# EAGLE design photodiode (EAGLE 8.3.1)
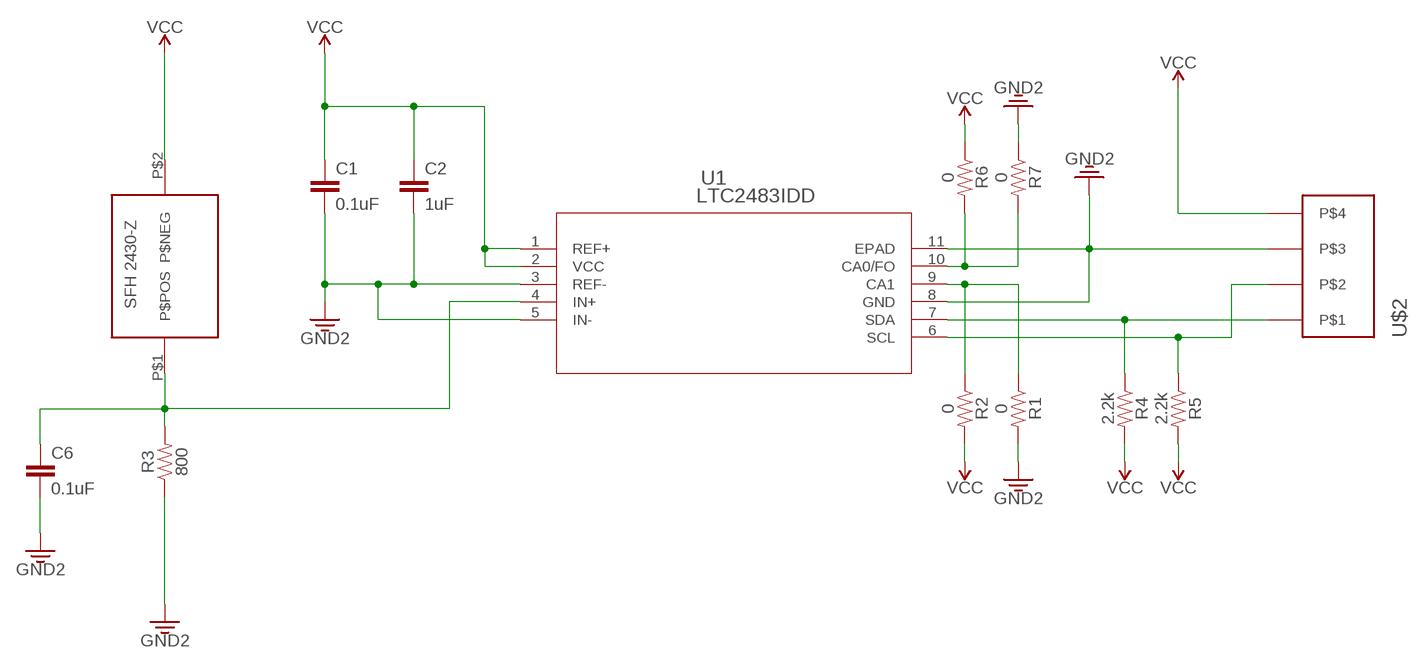
[diagram p0: schematic, sheet 1]

## Parts
C1  0.1uF  0.1UF-0603-100V-10%  [0603]
C2  1uF  0.1UF-0603-100V-10%  [0603]
C6  0.1uF  0.1UF-0603-100V-10%  [0603]
R1  0  RESISTOR0805  [0805]
R2  0  RESISTOR0805  [0805]
R3  800  RESISTOR0805  [0805]
R4  2.2k  RESISTOR0805  [0805]
R5  2.2k  RESISTOR0805  [0805]
R6  0  RESISTOR0805  [0805]
R7  0  RESISTOR0805  [0805]
U1  LTC2483IDD  [DFN-10_DD]
U$1  SFH-2430-Z  [DIL]
U$2  PICOLOCK_4PICOLOCK_4  [PICOLOCK_4]

## Nets
CA0: R6.2 R7.2 U1.10(CA0/FO)
CA1: R1.1 R2.1 U1.9(CA1)
GND: C1.2 C2.2 C6.2 R1.2 R3.1 R7.1 U1.3(REF-) U1.5(IN-) U1.8(GND) U1.11(EPAD) U$2.P$3 ; supply symbol labelled GND2
OUTPUT: C6.1 R3.2 U1.4(IN+) U$1.P$1(P$POS)
SCL: R5.1 U1.6(SCL) U$2.P$2
SDA: R4.1 U1.7(SDA) U$2.P$1
VCC: C1.1 C2.1 R2.2 R4.2 R5.2 R6.1 U1.1(REF+) U1.2(VCC) U$1.P$2(P$NEG) U$2.P$4

## Library data of the parts
C1 C6 = SparkFun-Capacitors:0.1UF: 0.1µF ceramic capacitors A capacitor is a passive two-terminal electrical component used to store electrical energy temporarily in an electric field.; PROD_ID: CAP-08390
C2 = SparkFun-Capacitors:0.1UF: 0.1µF ceramic capacitors A capacitor is a passive two-terminal electrical component used to store electrical energy temporarily in an electric field.; PROD_ID: CAP-08390; VALUE: 0.1uF
R1-R7 = SparkFun-Resistors:RESISTOR: Generic Resistor Package
U1 = LTC2483idd:LTC2483IDD; MANUFACTURER_PART_NUMBER: ltc2483idd; VENDOR: Linear Technology
U$1 = SFH 2430 Z:SFH-2430-Z
U$2 = DubSat1 Components:PICOLOCK_4

## Net classes
0 default: clearance 0.205 mm

## Board
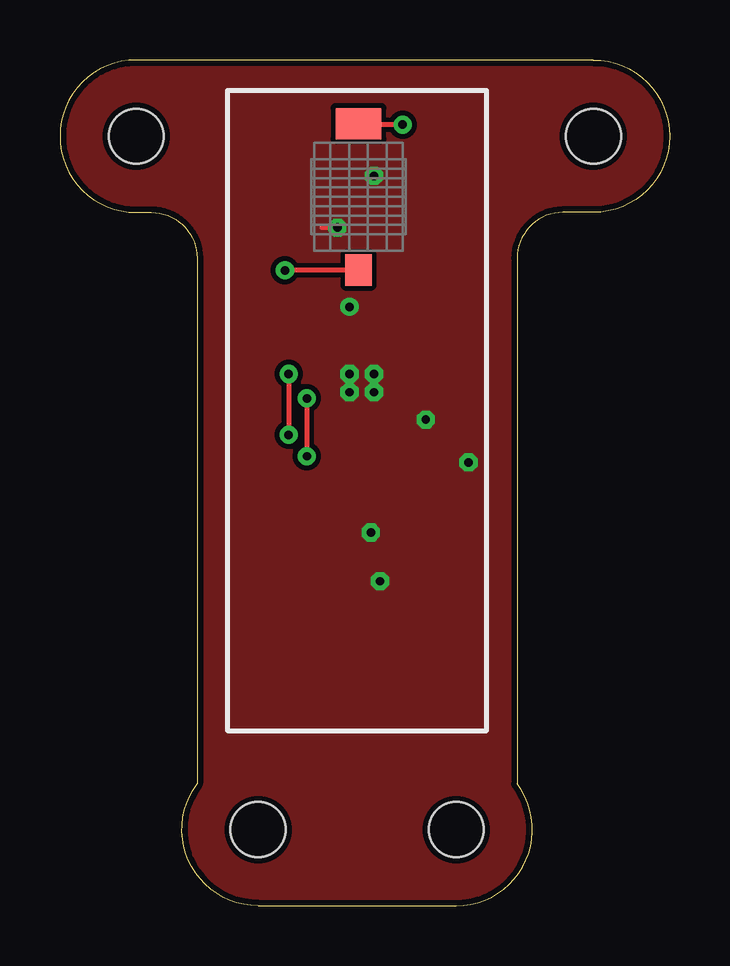
[diagram p1: board, top side]
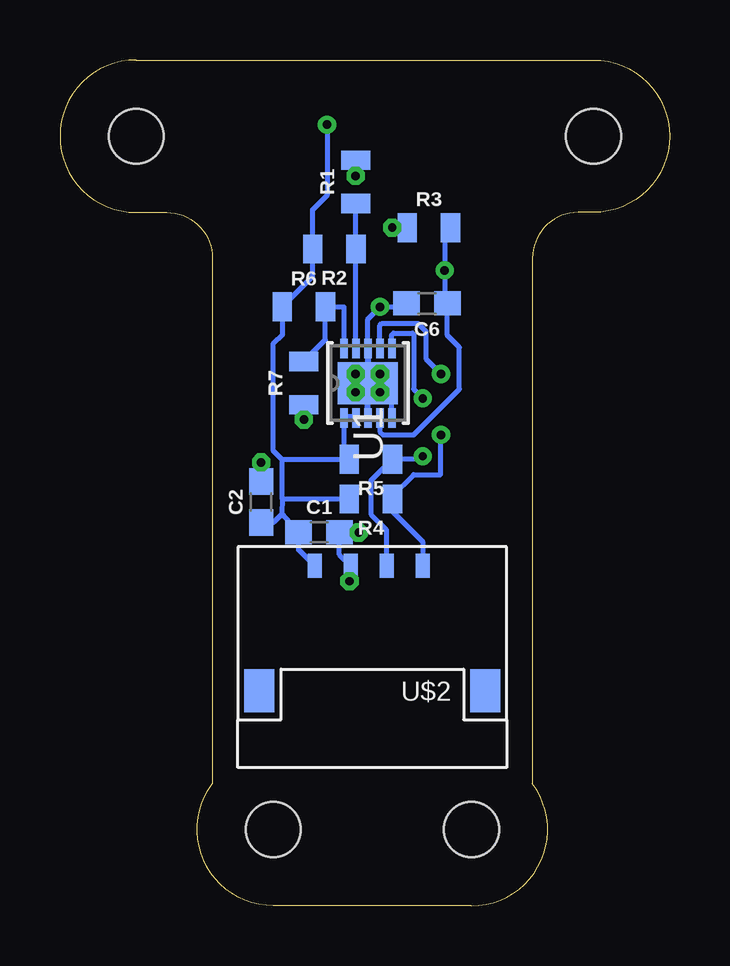
[diagram p2: board, bottom side, seen from below]

Size 25.4 x 35.24 mm. Coordinates in mm from the lower left corner, seen from the top.
Outline: 22.22,35.24 3.17,35.24 arc180 3.17,28.89 3.81,28.89 arc-90 5.71,26.99 5.71,5.08 arc127 8.25,0 16.51,0 arc127 19.05,5.08 19.05,26.99 arc-90 20.95,28.89 22.22,28.89 arc180 22.22,35.24
Copper layers (1*16): Top 0.035mm / dielectric 1.5mm / Bottom 0.035mm
Design rules "default *": minimum track width 6mil, minimum drill 0.35mm, track to track 8mil, track to pad 8mil, pad to pad 8mil, via to via 8mil, smd to smd 8mil, copper to edge 10mil, drill to drill 6mil, minimum pad ring 10mil, minimum via ring 8mil, stop-mask expansion 4mil, vias tented up to drill 0mil, thermal gap 10mil
Holes 2.29 mm at 8.25,3.18 16.51,3.18 22.22,32.07 3.17,32.07

### Footprints (pad centres in the part's own frame; a part is rotated, then mirrored left to right if it is on the bottom)
0603 = smd 1.1 x 1: 1 -0.85,0; 2 0.85,0
0805 = smd 0.8 x 1.2: 1 -0.9,0; 2 0.9,0
DFN-10_DD = smd 0.813 x 0.305: 1 -1.448,1; 2 -1.448,0.5; 3 -1.448,0; 4 -1.448,-0.5; 5 -1.448,-1; 6 1.448,-1; 7 1.448,-0.5; 8 1.448,0; 9 1.448,0.5; 10 1.448,1 | smd 1.753 x 2.489: 11 0,0
DIL = smd 1.3 x 1.1: P$1 -0.165,-0.055 | smd 1.3 x 1.9: P$2 5.935,-0.055
PICOLOCK_4 = smd 1.25 x 1.8: MNT@1 -2.605,5.2; MNT@2 6.805,5.2 | smd 0.6 x 1: P$1 0,0; P$2 1.5,0; P$3 3,0; P$4 4.5,0

### Placement (x,y rotation side)
C1  14.6,15.56 0 bottom
C2  17.02,16.83 90 bottom
C6  10.11,25.11 180 bottom
R1  13.08,30.16 90 bottom
R2  13.97,27.37 180 bottom
R3  10.03,28.26 0 bottom
R4  12.45,16.95 180 bottom
R5  12.45,18.61 180 bottom
R6  15.24,24.96 0 bottom
R7  15.24,21.78 90 bottom
U1  12.57,21.78 90 bottom
U$1  12.38,26.66 90 top
U$2  10.29,14.16 180 bottom

### Tracks (layer width: path | path; a pad name or v marks a point on that pad's centre or on a via)
CA0
  Bottom 0.203: U1.10 13.57,24.96 R6.2 14.34,23.58 R7.2
CA1
  Bottom 0.203: U1.9 13.08,26.36 R2.1 13.07,29.25 R1.1
  Bottom 0.254: U1.9
GND  (via drill 0.35)
  Top 0.203: v11.56,28.26 R3.1
  Bottom 0.203: U1.8 12.57,24.45 v12.06,24.96 11.11,24.96 C6.2 | U1.5 11.57,21.67 11.68,21.78 U1.11 12.47,21.68 | v12.95,15.56 13.91,15.68 C1.2 13.75,14.63 U$2.P$3 13.33,14.11 v13.33,13.53 | R3.1 v11.56,28.26 | v13.08,30.42 R1.2 | v17.02,18.48 C2.2 | v15.24,20.26 R7.1
  Bottom 0.254: U1.8 U1.11 | U1.3 12.57,21.58 12.47,21.68
  other vias: 12.06,21.4 12.06,22.16 13.08,22.16 13.08,21.4
  pour Top: -0.64,35.88 -0.64,0.32 26.03,0.32 26.03,35.88
OUTPUT  (via drill 0.35)
  Top 0.203: U$1.P$1 9.38,26.49 v9.37,26.48
  Bottom 0.203: U1.4 12.07,19.76 11.94,19.62 10.67,19.62 8.76,21.53 8.76,23.27 9.26,23.76 C6.1 9.37,25.22 v9.37,26.48 9.37,28.02 R3.2
SCL  (via drill 0.35)
  Top 0.203: v10.29,21.15 v10.29,18.73
  Bottom 0.203: v10.29,18.73 10.41,18.61 R5.1 12.45,17.72 12.45,16.32 11.81,15.68 11.81,14.18 U$2.P$2 | U1.6 11.57,23.8 11.5,23.87 10.72,23.87 10.67,23.81 10.67,21.53 v10.29,21.15
SDA  (via drill 0.35)
  Top 0.203: v9.52,22.16 v9.52,19.62
  Bottom 0.203: v9.52,19.62 9.54,18.85 9.54,17.97 10.67,17.97 11.55,17.09 R4.1 11.55,16.44 10.29,15.18 U$2.P$1 | U1.7 12.07,24.19 11.99,24.27 10.49,24.27 10.16,23.94 10.16,22.8 v9.52,22.16
VCC  (via drill 0.35)
  Top 0.203: v14.27,32.55 11.83,32.55 U$1.P$2
  Bottom 0.203: U1.1 13.57,18.83 R5.2 13.37,18.58 16.14,18.58 | 16.13,16.95 R4.2 | 16.13,16.95 16.14,16.97 16.14,18.58 | 16.14,16.33 C1.1 15.45,14.83 U$2.P$4 | 16.14,16.33 16.13,16.95 | 16.14,18.58 16.51,18.95 16.51,23.43 16.13,23.81 16.13,24.94 R6.1 14.87,26.23 R2.2 14.87,29.01 14.27,29.6 v14.27,32.55 | 16.14,16.33 16.49,15.98 C2.1
  Bottom 0.305: U1.2 U1.1